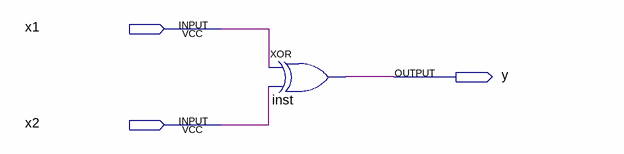
[diagram p0: schematic sheet]
// Quartus schematic lab15.bdf as structural Verilog: 1 symbols, 3 pins
module lab15 (
  input  x1,
  input  x2,
  output y
);

  xor inst (y, x1, x2);
endmodule
